# EAGLE schematic mainboard (EAGLE 9.6.2)

## Sheet 1 of 3
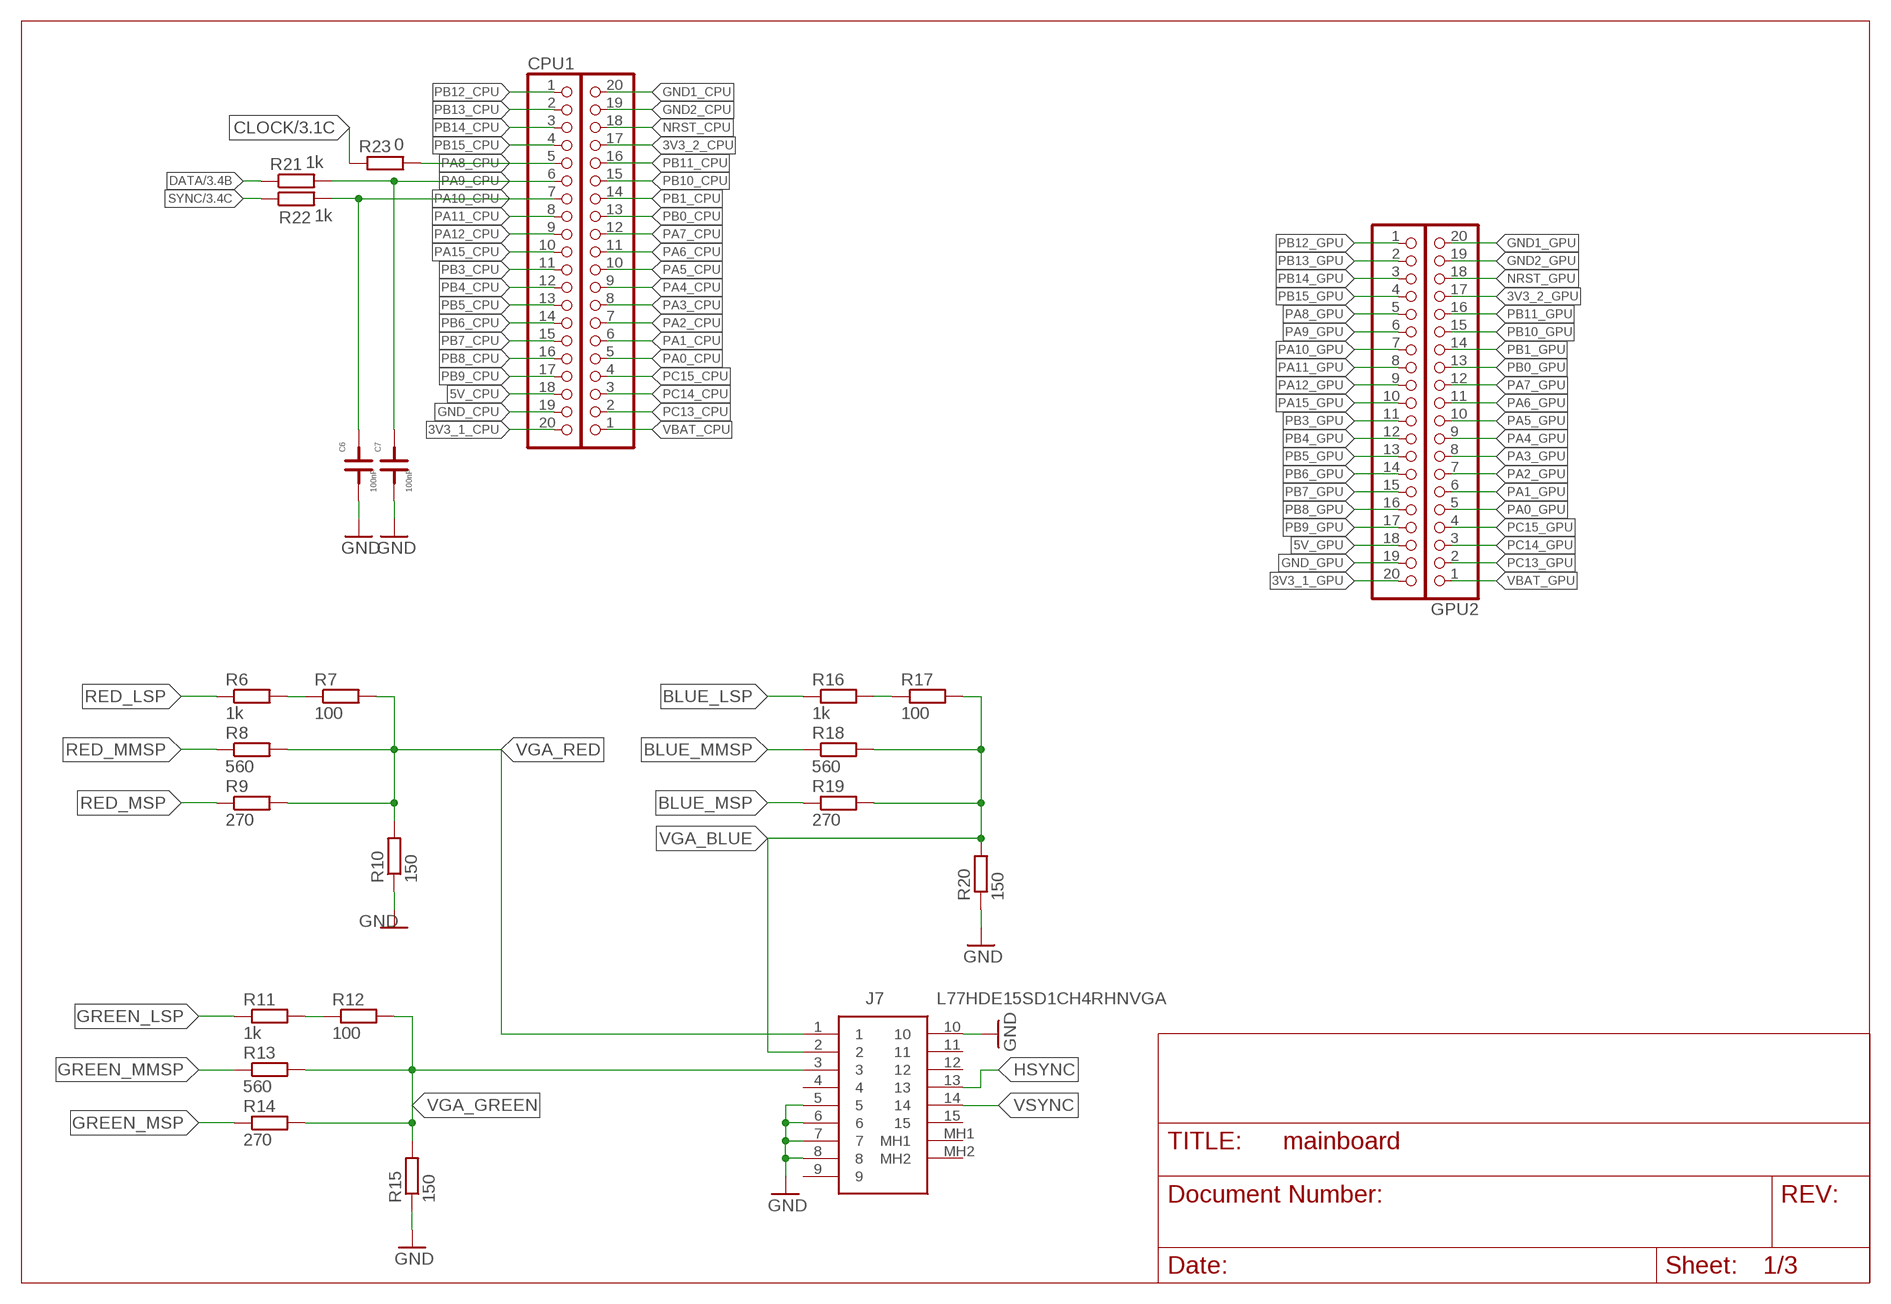
[diagram p0: schematic, sheet 1]

### Parts
C6  100nF  C1  [0805F]
C7  100nF  C1  [0805F]
CPU1  PINHD-1X20  [1X20]
CPU2  PINHD-1X20  [1X20]
GPU1  PINHD-1X20  [1X20]
GPU2  PINHD-1X20  [1X20]
J7  L77HDE15SD1CH4RHNVGA  [L77HDE15SD1CH4RHNVGA]
R6  1k  R-EU_R0805  [R0805]
R7  100  R-EU_R0805  [R0805]
R8  560  R-EU_R0805  [R0805]
R9  270  R-EU_R0805  [R0805]
R10  150  R-EU_R0805  [R0805]
R11  1k  R-EU_R0805  [R0805]
R12  100  R-EU_R0805  [R0805]
R13  560  R-EU_R0805  [R0805]
R14  270  R-EU_R0805  [R0805]
R15  150  R-EU_R0805  [R0805]
R16  1k  R-EU_R0805  [R0805]
R17  100  R-EU_R0805  [R0805]
R18  560  R-EU_R0805  [R0805]
R19  270  R-EU_R0805  [R0805]
R20  150  R-EU_R0805  [R0805]
R21  1k  R-EU_R0805  [R0805]
R22  1k  R-EU_R0805  [R0805]
R23  0  R-EU_R0805  [R0805]

### Nets
3V3_1_CPU: CPU1.20
3V3_1_GPU: GPU1.20
3V3_2_CPU: CPU2.17
3V3_2_GPU: GPU2.17
5V_CPU: CPU1.18
5V_GPU: GPU1.18
BLUE_LSP: R16.1
BLUE_MMSP: R18.1
BLUE_MSP: R19.1
CLOCK: R23.1 ; also sheet 3
DATA: R21.1 ; also sheet 3
GND: C6.1 C7.1 J7.5 J7.6 J7.7 J7.8 J7.10 R10.1 R15.1 R20.1 ; also sheet 2,3
GND1_CPU: CPU2.20
GND1_GPU: GPU2.20
GND2_CPU: CPU2.19
GND2_GPU: GPU2.19
GND_CPU: CPU1.19
GND_GPU: GPU1.19
GREEN_LSP: R11.1
GREEN_MMSP: R13.1
GREEN_MSP: R14.1
HSYNC: J7.13
N$16: R6.2 R7.1
N$18: R11.2 R12.1
N$21: R16.2 R17.1
NRST_CPU: CPU2.18
NRST_GPU: GPU2.18
PA0_CPU: CPU2.5
PA0_GPU: GPU2.5
PA1_CPU: CPU2.6
PA1_GPU: GPU2.6
PA2_CPU: CPU2.7
PA2_GPU: GPU2.7
PA3_CPU: CPU2.8
PA3_GPU: GPU2.8
PA4_CPU: CPU2.9
PA4_GPU: GPU2.9
PA5_CPU: CPU2.10
PA5_GPU: GPU2.10
PA6_CPU: CPU2.11
PA6_GPU: GPU2.11
PA7_CPU: CPU2.12
PA7_GPU: GPU2.12
PA8_CPU: CPU1.5 R23.2
PA8_GPU: GPU1.5
PA9_CPU: C7.2 CPU1.6 R21.2
PA9_GPU: GPU1.6
PA10_CPU: C6.2 CPU1.7 R22.2
PA10_GPU: GPU1.7
PA11_CPU: CPU1.8
PA11_GPU: GPU1.8
PA12_CPU: CPU1.9
PA12_GPU: GPU1.9
PA15_CPU: CPU1.10
PA15_GPU: GPU1.10
PB0_CPU: CPU2.13
PB0_GPU: GPU2.13
PB1_CPU: CPU2.14
PB1_GPU: GPU2.14
PB3_CPU: CPU1.11
PB3_GPU: GPU1.11
PB4_CPU: CPU1.12
PB4_GPU: GPU1.12
PB5_CPU: CPU1.13
PB5_GPU: GPU1.13
PB6_CPU: CPU1.14
PB6_GPU: GPU1.14
PB7_CPU: CPU1.15
PB7_GPU: GPU1.15
PB8_CPU: CPU1.16
PB8_GPU: GPU1.16
PB9_CPU: CPU1.17
PB9_GPU: GPU1.17
PB10_CPU: CPU2.15
PB10_GPU: GPU2.15
PB11_CPU: CPU2.16
PB11_GPU: GPU2.16
PB12_CPU: CPU1.1
PB12_GPU: GPU1.1
PB13_CPU: CPU1.2
PB13_GPU: GPU1.2
PB14_CPU: CPU1.3
PB14_GPU: GPU1.3
PB15_CPU: CPU1.4
PB15_GPU: GPU1.4
PC13_CPU: CPU2.2
PC13_GPU: GPU2.2
PC14_CPU: CPU2.3
PC14_GPU: GPU2.3
PC15_CPU: CPU2.4
PC15_GPU: GPU2.4
RED_LSP: R6.1
RED_MMSP: R8.1
RED_MSP: R9.1
SYNC: R22.1 ; also sheet 3
VBAT_CPU: CPU2.1
VBAT_GPU: GPU2.1
VGA_BLUE: J7.2 R17.2 R18.2 R19.2 R20.2
VGA_GREEN: J7.3 R12.2 R13.2 R14.2 R15.2
VGA_RED: J7.1 R7.2 R8.2 R9.2 R10.2
VSYNC: J7.14
Unconnected: J7.4 J7.9 J7.11 J7.12 J7.15 J7.MH1 J7.MH2

## Sheet 2 of 3: I/O
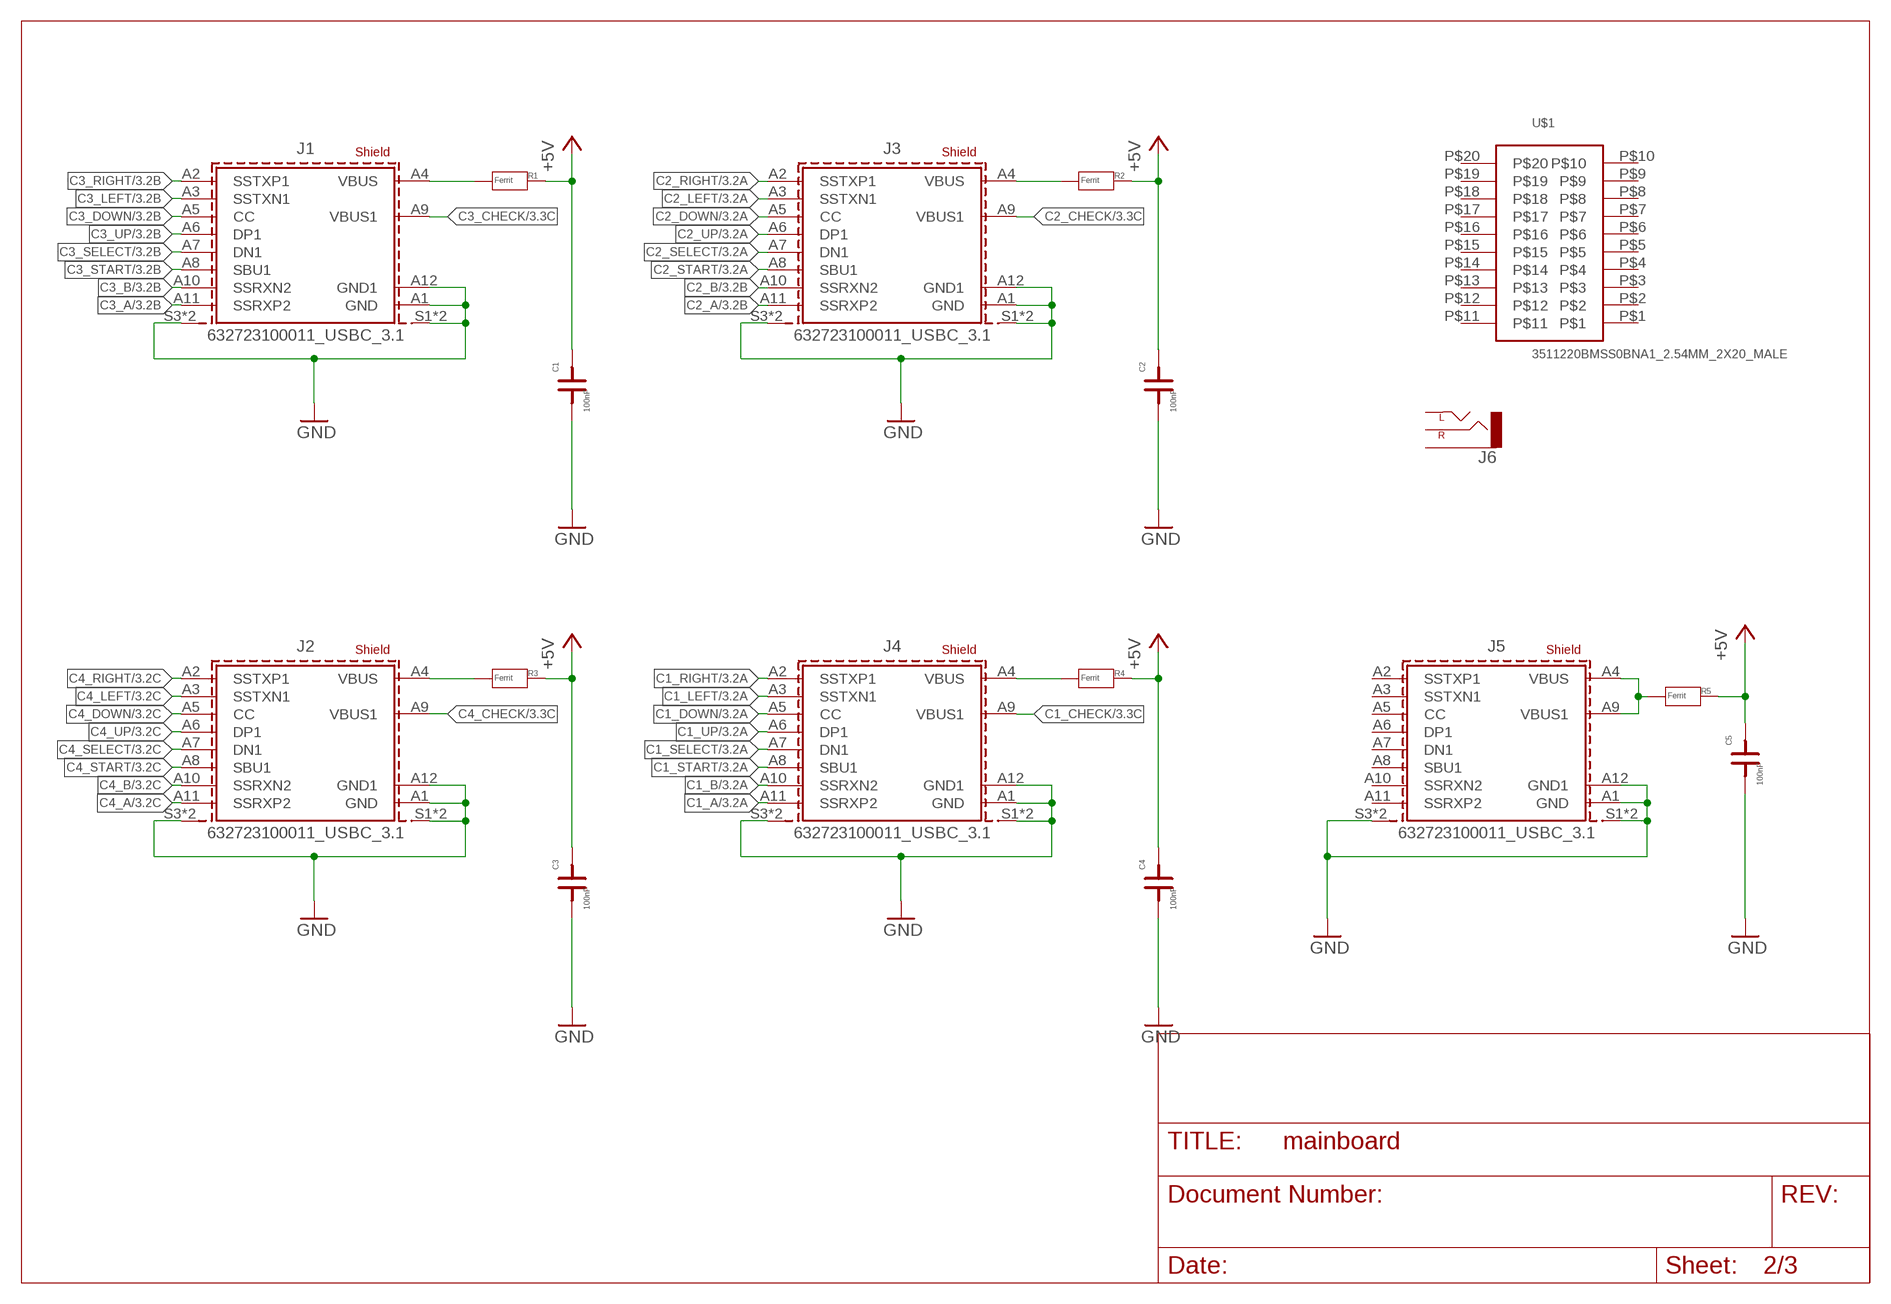
[diagram p1: schematic, sheet 2]

### Parts
C1  100nF  C1  [0805F]
C2  100nF  C1  [0805F]
C3  100nF  C1  [0805F]
C4  100nF  C1  [0805F]
C5  100nF  C1  [0805F]
J1  632723100011_USBC_3.1  [632723100011_USBC_3.1]
J2  632723100011_USBC_3.1  [632723100011_USBC_3.1]
J3  632723100011_USBC_3.1  [632723100011_USBC_3.1]
J4  632723100011_USBC_3.1  [632723100011_USBC_3.1]
J5  632723100011_USBC_3.1  [632723100011_USBC_3.1]
J6  AUDIO_JACK_2.5MM_2.5MM  [STEREOJACK2.5MM_STEREOJACK2.5MM]
R1  Ferrit  R2  [1206]
R2  Ferrit  R2  [1206]
R3  Ferrit  R2  [1206]
R4  Ferrit  R2  [1206]
R5  Ferrit  R2  [1206]
U$1  3511220BMSS0BNA1_2.54MM_2X20_MALE  [3511220BMSS0BNA1_2.54MM_2X20_MALE]

### Nets
+5V: C1.2 C2.2 C3.2 C4.2 C5.2 R1.2 R2.2 R3.2 R4.2 R5.2 ; also sheet 3
C1_A: J4.A11(SSRXP2) ; also sheet 3
C1_B: J4.A10(SSRXN2) ; also sheet 3
C1_CHECK: J4.A9(VBUS1) ; also sheet 3
C1_DOWN: J4.A5(CC) ; also sheet 3
C1_LEFT: J4.A3(SSTXN1) ; also sheet 3
C1_RIGHT: J4.A2(SSTXP1) ; also sheet 3
C1_SELECT: J4.A7(DN1) ; also sheet 3
C1_START: J4.A8(SBU1) ; also sheet 3
C1_UP: J4.A6(DP1) ; also sheet 3
C2_A: J3.A11(SSRXP2) ; also sheet 3
C2_B: J3.A10(SSRXN2) ; also sheet 3
C2_CHECK: J3.A9(VBUS1) ; also sheet 3
C2_DOWN: J3.A5(CC) ; also sheet 3
C2_LEFT: J3.A3(SSTXN1) ; also sheet 3
C2_RIGHT: J3.A2(SSTXP1) ; also sheet 3
C2_SELECT: J3.A7(DN1) ; also sheet 3
C2_START: J3.A8(SBU1) ; also sheet 3
C2_UP: J3.A6(DP1) ; also sheet 3
C3_A: J1.A11(SSRXP2) ; also sheet 3
C3_B: J1.A10(SSRXN2) ; also sheet 3
C3_CHECK: J1.A9(VBUS1) ; also sheet 3
C3_DOWN: J1.A5(CC) ; also sheet 3
C3_LEFT: J1.A3(SSTXN1) ; also sheet 3
C3_RIGHT: J1.A2(SSTXP1) ; also sheet 3
C3_SELECT: J1.A7(DN1) ; also sheet 3
C3_START: J1.A8(SBU1) ; also sheet 3
C3_UP: J1.A6(DP1) ; also sheet 3
C4_A: J2.A11(SSRXP2) ; also sheet 3
C4_B: J2.A10(SSRXN2) ; also sheet 3
C4_CHECK: J2.A9(VBUS1) ; also sheet 3
C4_DOWN: J2.A5(CC) ; also sheet 3
C4_LEFT: J2.A3(SSTXN1) ; also sheet 3
C4_RIGHT: J2.A2(SSTXP1) ; also sheet 3
C4_SELECT: J2.A7(DN1) ; also sheet 3
C4_START: J2.A8(SBU1) ; also sheet 3
C4_UP: J2.A6(DP1) ; also sheet 3
GND: C1.1 C2.1 C3.1 C4.1 C5.1 J1.A1(GND) J1.A12(GND1) J1.S1(SHIELD1) J1.S2(SHIELD1) J1.S3(SHIELD) J1.S4(SHIELD) J2.A1(GND) J2.A12(GND1) J2.S1(SHIELD1) J2.S2(SHIELD1) J2.S3(SHIELD) J2.S4(SHIELD) J3.A1(GND) J3.A12(GND1) J3.S1(SHIELD1) J3.S2(SHIELD1) J3.S3(SHIELD) J3.S4(SHIELD) J4.A1(GND) J4.A12(GND1) J4.S1(SHIELD1) J4.S2(SHIELD1) J4.S3(SHIELD) J4.S4(SHIELD) J5.A1(GND) J5.A12(GND1) J5.S1(SHIELD1) J5.S2(SHIELD1) J5.S3(SHIELD) J5.S4(SHIELD) ; also sheet 1,3
N$1: J5.A4(VBUS) J5.A9(VBUS1) R5.1
N$2: J3.A4(VBUS) R2.1
N$3: J1.A4(VBUS) R1.1
N$4: J2.A4(VBUS) R3.1
N$5: J4.A4(VBUS) R4.1
Unconnected: J5.A2(SSTXP1) J5.A3(SSTXN1) J5.A5(CC) J5.A6(DP1) J5.A7(DN1) J5.A8(SBU1) J5.A10(SSRXN2) J5.A11(SSRXP2) J6.RING1(SLEEVE) J6.SHIELD(LEFT) J6.TIP(RIGHT) U$1.P$1 U$1.P$2 U$1.P$3 U$1.P$4 U$1.P$5 U$1.P$6 U$1.P$7 U$1.P$8 U$1.P$9 U$1.P$10 U$1.P$11 U$1.P$12 U$1.P$13 U$1.P$14 U$1.P$15 U$1.P$16 U$1.P$17 U$1.P$18 U$1.P$19 U$1.P$20

## Sheet 3 of 3: Controller Logic
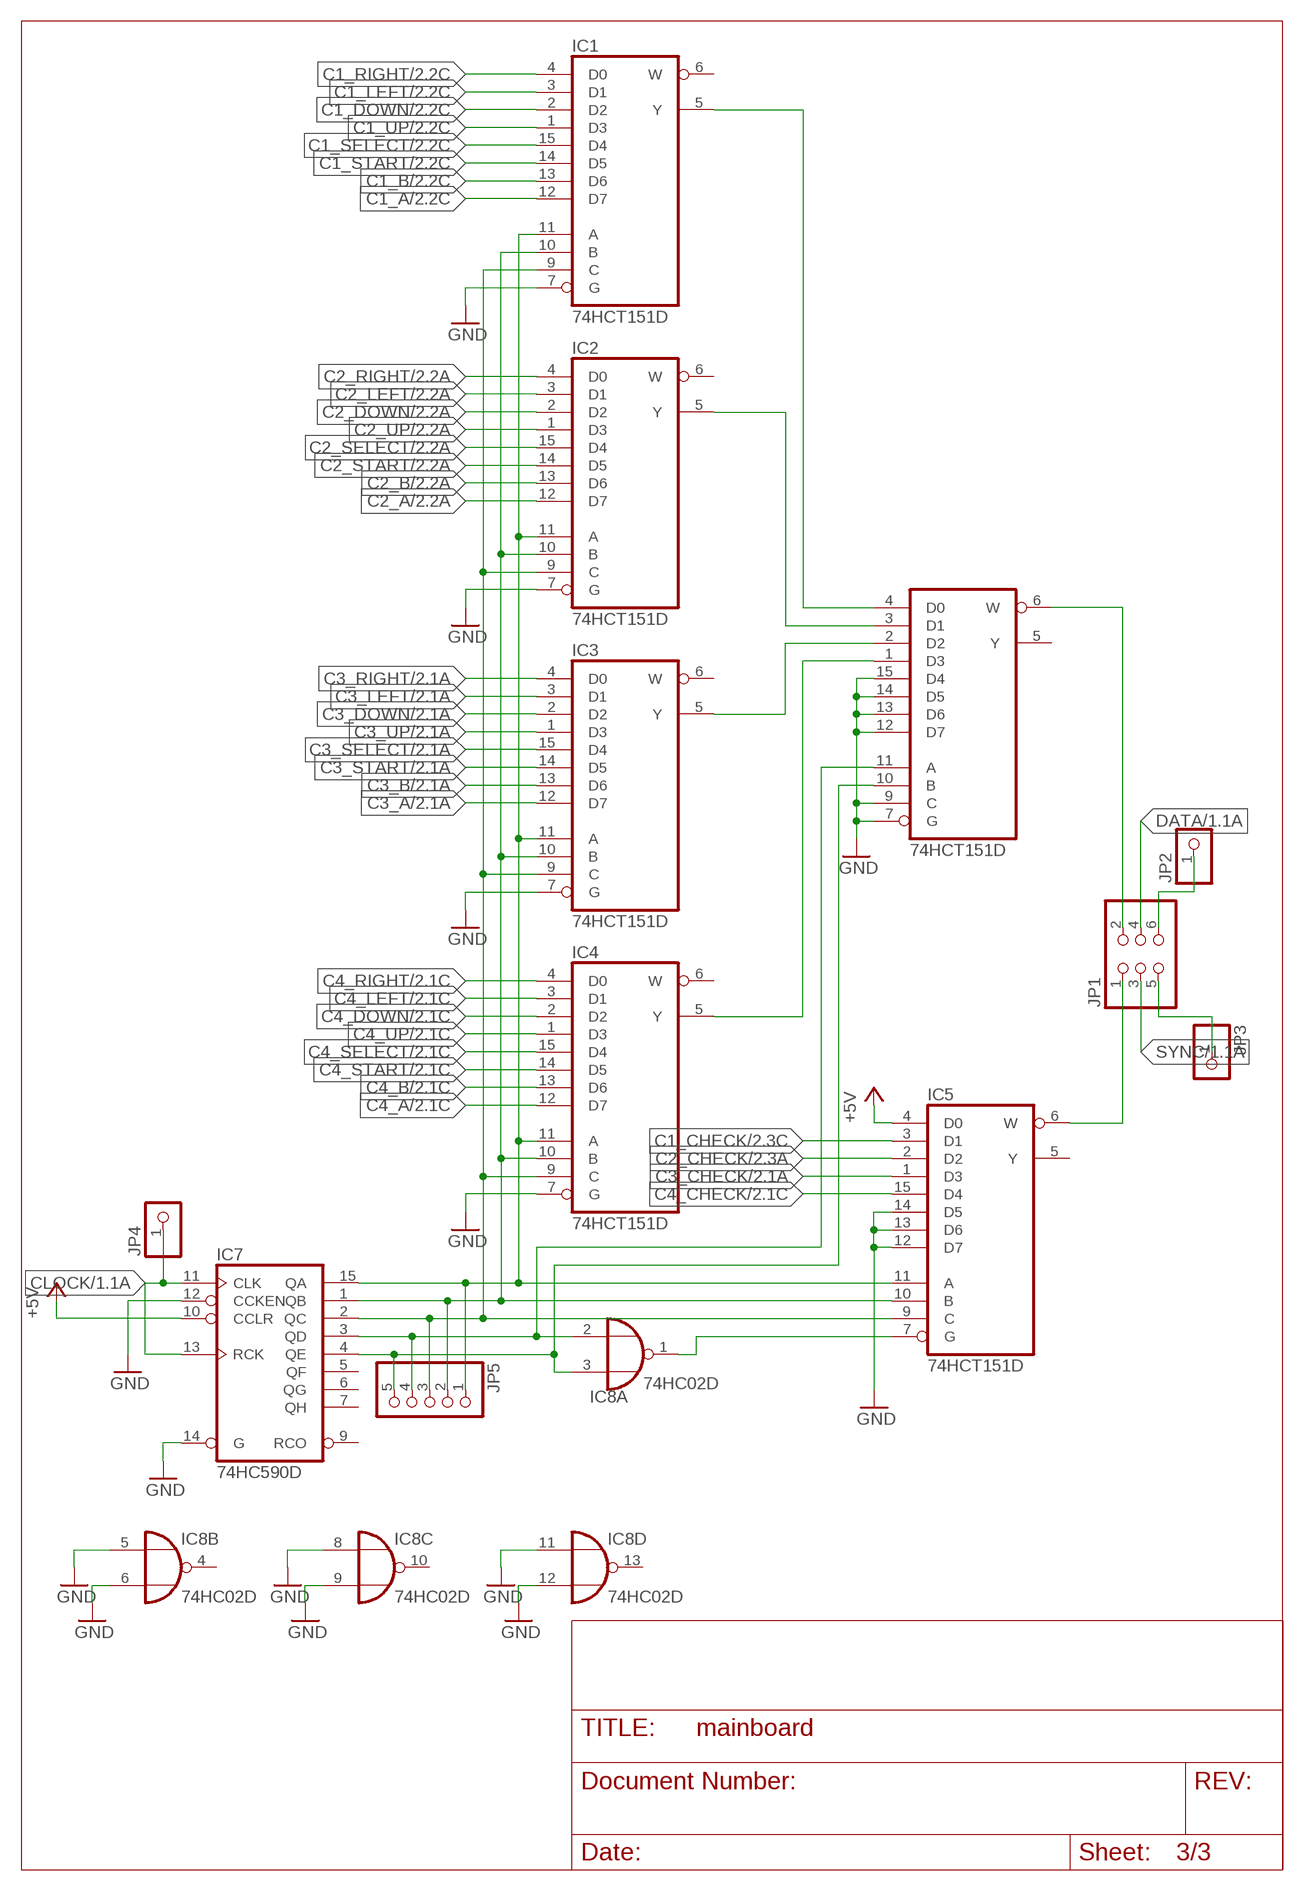
[diagram p2: schematic, sheet 3]

### Parts
IC1  74HCT151D  [SO16]
IC2  74HCT151D  [SO16]
IC3  74HCT151D  [SO16]
IC4  74HCT151D  [SO16]
IC5  74HCT151D  [SO16]
IC6  74HCT151D  [SO16]
IC7  74HC590D  [SO16]
IC8  74HC02D  [SO14]
JP1  PINHD-2X3  [2X03]
JP2  PINHD-1X1  [1X01]
JP3  PINHD-1X1  [1X01]
JP4  PINHD-1X1  [1X01]
JP5  PINHD-1X5  [1X05]

### Nets
+5V: IC5.4(D0) IC7.10(CCLR) ; also sheet 2
C1_A: IC1.12(D7) ; also sheet 2
C1_B: IC1.13(D6) ; also sheet 2
C1_CHECK: IC5.3(D1) ; also sheet 2
C1_DOWN: IC1.2(D2) ; also sheet 2
C1_LEFT: IC1.3(D1) ; also sheet 2
C1_RIGHT: IC1.4(D0) ; also sheet 2
C1_SELECT: IC1.15(D4) ; also sheet 2
C1_START: IC1.14(D5) ; also sheet 2
C1_UP: IC1.1(D3) ; also sheet 2
C2_A: IC2.12(D7) ; also sheet 2
C2_B: IC2.13(D6) ; also sheet 2
C2_CHECK: IC5.2(D2) ; also sheet 2
C2_DOWN: IC2.2(D2) ; also sheet 2
C2_LEFT: IC2.3(D1) ; also sheet 2
C2_RIGHT: IC2.4(D0) ; also sheet 2
C2_SELECT: IC2.15(D4) ; also sheet 2
C2_START: IC2.14(D5) ; also sheet 2
C2_UP: IC2.1(D3) ; also sheet 2
C3_A: IC3.12(D7) ; also sheet 2
C3_B: IC3.13(D6) ; also sheet 2
C3_CHECK: IC5.1(D3) ; also sheet 2
C3_DOWN: IC3.2(D2) ; also sheet 2
C3_LEFT: IC3.3(D1) ; also sheet 2
C3_RIGHT: IC3.4(D0) ; also sheet 2
C3_SELECT: IC3.15(D4) ; also sheet 2
C3_START: IC3.14(D5) ; also sheet 2
C3_UP: IC3.1(D3) ; also sheet 2
C4_A: IC4.12(D7) ; also sheet 2
C4_B: IC4.13(D6) ; also sheet 2
C4_CHECK: IC5.15(D4) ; also sheet 2
C4_DOWN: IC4.2(D2) ; also sheet 2
C4_LEFT: IC4.3(D1) ; also sheet 2
C4_RIGHT: IC4.4(D0) ; also sheet 2
C4_SELECT: IC4.15(D4) ; also sheet 2
C4_START: IC4.14(D5) ; also sheet 2
C4_UP: IC4.1(D3) ; also sheet 2
CLOCK: IC7.11(CLK) IC7.13(RCK) JP4.1 ; also sheet 1
DATA: JP1.4 ; also sheet 1
GND: IC1.7(G) IC2.7(G) IC3.7(G) IC4.7(G) IC5.12(D7) IC5.13(D6) IC5.14(D5) IC6.7(G) IC6.9(C) IC6.12(D7) IC6.13(D6) IC6.14(D5) IC6.15(D4) IC7.12(CCKEN) IC7.14(G) IC8.5(B:I0) IC8.6(B:I1) IC8.8(C:I0) IC8.9(C:I1) IC8.11(D:I0) IC8.12(D:I1) ; also sheet 1,2
N$8: JP1.6 JP2.1
N$9: IC1.11(A) IC2.11(A) IC3.11(A) IC4.11(A) IC5.11(A) IC7.15(QA) JP5.1
N$10: IC1.10(B) IC2.10(B) IC3.10(B) IC4.10(B) IC5.10(B) IC7.1(QB) JP5.2
N$11: IC1.9(C) IC2.9(C) IC3.9(C) IC4.9(C) IC5.9(C) IC7.2(QC) JP5.3
N$12: IC2.5(Y) IC6.3(D1)
N$13: IC1.5(Y) IC6.4(D0)
N$14: IC3.5(Y) IC6.2(D2)
N$15: IC4.5(Y) IC6.1(D3)
N$17: IC5.7(G) IC8.1(A:O)
N$19: IC6.10(B) IC7.4(QE) IC8.3(A:I1) JP5.5
N$20: IC5.6(W) JP1.1
N$22: IC6.6(W) JP1.2
N$23: JP1.5 JP3.1
N$24: IC6.11(A) IC7.3(QD) IC8.2(A:I0) JP5.4
SYNC: JP1.3 ; also sheet 1
Unconnected: IC1.6(W) IC2.6(W) IC3.6(W) IC4.6(W) IC5.5(Y) IC6.5(Y) IC7.5(QF) IC7.6(QG) IC7.7(QH) IC7.9(RCO) IC8.4(B:O) IC8.10(C:O) IC8.13(D:O)

## Power pins joined to a net without a drawn wire
GND: IC1.8(GND) IC2.8(GND) IC3.8(GND) IC4.8(GND) IC5.8(GND) IC6.8(GND) IC7.8(GND) IC8.7(P:GND)
VCC: IC1.16(VCC) IC2.16(VCC) IC3.16(VCC) IC4.16(VCC) IC5.16(VCC) IC6.16(VCC) IC7.16(VCC) IC8.14(P:VCC)

## Library data of the parts
C1-C7 = deto:C
CPU1 CPU2 GPU1 GPU2 = pinhead:PINHD-1X20: PIN HEADER
IC1-IC6 = 74xx-eu:74*151: Data SELECTOR/MULTIPLEXER
IC7 = 74xx-eu:74*590: 8-bit binary COUNTER, output register
IC8 = 74xx-eu:74*02: Quad 2-input NOR gate
J1-J5 = Eagle_WR-USB (rev22c):632723100011_USBC_3.1: WR-COM USB 3.1 Type C Receptacle Horizontal THT/SMT Kind Properties Durability:10 000 Mating cycles Connector Type:USB 3.1 Type C Gender:Receptacle Type:Horizontal General Information Operating Temperature:-40up to +105 °C Compliance:RoHS Electrical Properties Working Voltage:20V (DC) Withstanding Voltage:100V (AC) Contact Resistance:30 mΩ Material Properties Insulator Material:LCP Insulator Flammability Rating:UL94 V-0 Color:Black Contact Material:Brass Contact Plating:2µ” Gold over 30µ” Pd-Ni Contact Type:Stamped Shielding Material:Steel Shielding Plating:Matte Tin <https://www.we-online.com/catalog/media/o144501v209%20Family_WR-COM_632723x00011.jpg> Details see: https://www.we-online.com/catalog/en/COM_3_1_THR_SMT_TYPE_C_RECEPTACLE_HORIZONTAL/ Updated by Ella Wu 2021-09-28 2021 (C) Würth Elektronik
J6 = SparkFun-Connectors:AUDIO_JACK_2.5MM: Audio Jack 2.5mm variants of PTH and SMT audio jacks. SparkFun Products: SparkFun PicoBoard <https://www.sparkfun.com/products/11888>- 2.5mm SMD; PROD_ID: CONN-09878
J7 = L77HDE15SD1CH4RHNVGA:L77HDE15SD1CH4RHNVGA: D-Sub High Density Connectors Dsub, Stamped Signal 3A, High Density, Right Angle PCB Thru Hole, FP=8.89mm (.350"), 15 Socket, Bright Tin Shell, Flash Gold, 4-40 Rear Insert, Ground Tab with Boardlock, High Temp, Nickel Shell, VGA Source: Datasheet <https://componentsearchengine.com/Datasheets/1/L77HDE15SD1CH4RHNVGA.pdf>; ARROW_PART_NUMBER: L77HDE15SD1CH4RHNVGA; ARROW_PRICE-STOCK: https://www.arrow.com/en/products/l77hde15sd1ch4rhnvga/amphenol-fci?region=nac; DESCRIPTION: D-Sub High Density Connectors Dsub, Stamped Signal 3A, High Density, Right Angle PCB Thru Hole, FP=8.89mm (.350"), 15 Socket, Bright Tin Shell, Flash Gold, 4-40 Rear Insert, Ground Tab with Boardlock, High Temp, Nickel Shell, VGA; HEIGHT: 12.55mm; MANUFACTURER_NAME: Amphenol; MANUFACTURER_PART_NUMBER: L77HDE15SD1CH4RHNVGA; MOUSER_PART_NUMBER: 523-7HDE15SDH4RHNVGA; MOUSER_PRICE-STOCK: https://www.mouser.co.uk/ProductDetail/Amphenol-Commercial-Products/L77HDE15SD1CH4RHNVGA?qs=f9yNj16SXrKPVxRw%2FcVQYg%3D%3D
JP1 = pinhead:PINHD-2X3: PIN HEADER
JP2-JP4 = pinhead:PINHD-1X1: PIN HEADER
JP5 = pinhead:PINHD-1X5: PIN HEADER
R1-R5 = deto:R: Widerstand 400 mil - 0805 - 1206
R6-R23 = rcl:R-EU_: RESISTOR, European symbol; SPICEPREFIX: R
U$1 = BtoB_connector:3511220BMSS0BNA1_2.54MM_2X20_MALE